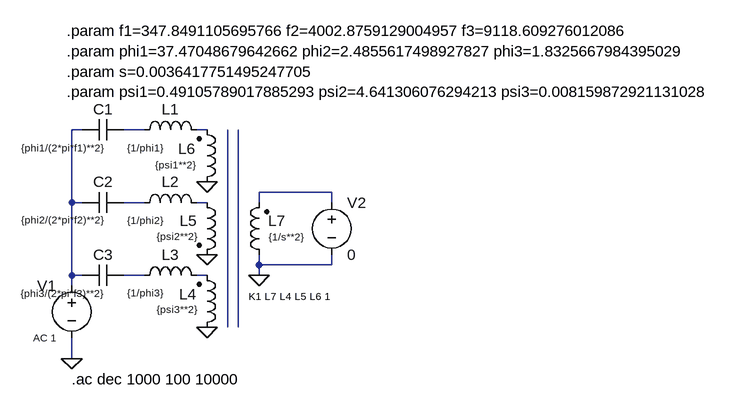
[diagram p0: schematic ME_Diaphragm_3DOF_linear.asc]
ME_Diaphragm_3DOF_linear.asc, the LTspice schematic file:
Version 4
SHEET 1 27848 15192
WIRE 25392 14592 25376 14592
WIRE 25488 14592 25456 14592
WIRE 25584 14592 25568 14592
WIRE 25776 14688 25664 14688
WIRE 25376 14704 25376 14592
WIRE 25392 14704 25376 14704
WIRE 25488 14704 25456 14704
WIRE 25584 14704 25568 14704
WIRE 25664 14704 25664 14688
WIRE 25776 14704 25776 14688
WIRE 25664 14800 25664 14784
WIRE 25776 14800 25776 14784
WIRE 25776 14800 25664 14800
WIRE 25376 14816 25376 14704
WIRE 25392 14816 25376 14816
WIRE 25488 14816 25456 14816
WIRE 25584 14816 25568 14816
WIRE 25664 14816 25664 14800
WIRE 25376 14832 25376 14816
WIRE 25376 14944 25376 14912
FLAG 25376 14944 0
FLAG 25584 14784 0
FLAG 25584 14672 0
FLAG 25584 14896 0
FLAG 25664 14816 0
SYMBOL cap 25456 14576 R90
WINDOW 0 0 32 VBottom 2
WINDOW 3 33 95 VTop 1
SYMATTR InstName C1
SYMATTR Value {phi1/(2*pi*f1)**2}
SYMBOL cap 25456 14688 R90
WINDOW 0 0 32 VBottom 2
WINDOW 3 32 95 VTop 1
SYMATTR InstName C2
SYMATTR Value {phi2/(2*pi*f2)**2}
SYMBOL ind 25472 14608 R270
WINDOW 0 32 56 VTop 2
WINDOW 3 -1 17 VBottom 1
SYMATTR InstName L1
SYMATTR Value {1/phi1}
SYMBOL ind 25472 14720 R270
WINDOW 0 32 56 VTop 2
WINDOW 3 -1 17 VBottom 1
SYMATTR InstName L2
SYMATTR Value {1/phi2}
SYMBOL voltage 25376 14816 M0
WINDOW 3 24 96 Left 1
SYMATTR Value AC 1
SYMATTR InstName V1
SYMBOL cap 25456 14800 R90
WINDOW 0 0 32 VBottom 2
WINDOW 3 33 96 VTop 1
SYMATTR InstName C3
SYMATTR Value {phi3/(2*pi*f3)**2}
SYMBOL ind 25472 14832 R270
WINDOW 0 32 56 VTop 2
WINDOW 3 0 17 VBottom 1
SYMATTR InstName L3
SYMATTR Value {1/phi3}
SYMBOL ind2 25568 14912 M180
WINDOW 0 0 67 Right 2
WINDOW 3 0 44 Right 1
SYMATTR InstName L4
SYMATTR Value {psi3**2}
SYMATTR Type ind
SYMBOL ind2 25568 14688 R0
WINDOW 0 1 44 Right 2
WINDOW 3 0 68 Right 1
SYMATTR InstName L5
SYMATTR Value {psi2**2}
SYMATTR Type ind
SYMBOL ind2 25568 14688 M180
WINDOW 0 -1 67 Right 2
WINDOW 3 -2 42 Right 1
SYMATTR InstName L6
SYMATTR Value {psi1**2}
SYMATTR Type ind
SYMBOL ind2 25680 14800 R180
WINDOW 0 2 68 Right 2
WINDOW 3 1 43 Right 1
SYMATTR InstName L7
SYMATTR Value {1/s**2}
SYMATTR Type ind
SYMBOL voltage 25776 14688 R0
SYMATTR InstName V2
SYMATTR Value 0
TEXT 25376 14976 Left 2 !.ac dec 1000 100 10000
TEXT 25368 14440 Left 2 !.param f1=347.8491105695766 f2=4002.8759129004957 f3=9118.609276012086\n.param phi1=37.47048679642662 phi2=2.4855617498927827 phi3=1.8325667984395029\n.param s=0.0036417751495247705\n.param psi1=0.49105789017885293 psi2=4.641306076294213 psi3=0.008159872921131028
TEXT 25648 14848 Left 1 !K1 L7 L4 L5 L6 1
LINE Normal 25616 14896 25616 14592
LINE Normal 25632 14896 25632 14592

The netlist it stands for:
* ME_Diaphragm_3DOF_linear.asc
C1 N002 N001 {phi1/(2*pi*f1)**2}
C2 N005 N001 {phi2/(2*pi*f2)**2}
L1 N002 N003 {1/phi1}
L2 N005 N006 {1/phi2}
V1 N001 0 AC 1
C3 N007 N001 {phi3/(2*pi*f3)**2}
L3 N007 N008 {1/phi3}
L4 0 N008 {psi3**2}
L5 N006 0 {psi2**2}
L6 0 N003 {psi1**2}
L7 0 N004 {1/s**2}
V2 N004 0 0
.ac dec 1000 100 10000
.param f1=347.8491105695766 f2=4002.8759129004957 f3=9118.609276012086
.param phi1=37.47048679642662 phi2=2.4855617498927827 phi3=1.8325667984395029
.param s=0.0036417751495247705
.param psi1=0.49105789017885293 psi2=4.641306076294213 psi3=0.008159872921131028
K1 L7 L4 L5 L6 1
.backanno
.end

* Results of the author's LTspice run, read from the files saved beside the schematic
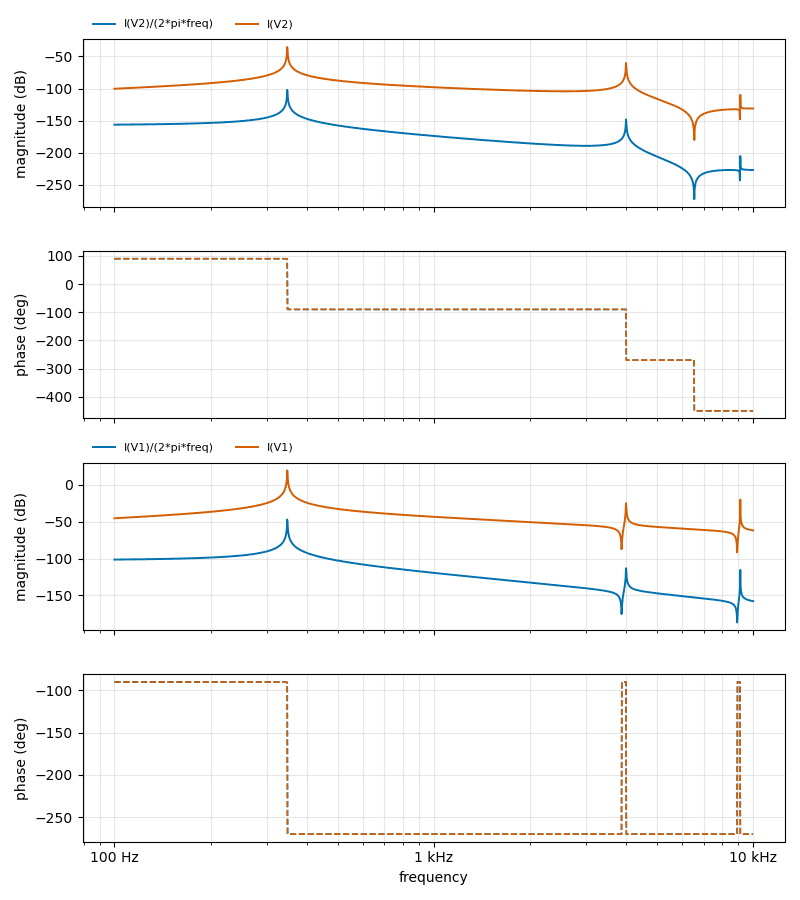
[diagram p1: AC Analysis of ME_Diaphragm_3DOF_linear.asc, plotted from the saved traces]
* AC Analysis, 1 run:
*   I(V2)/(2*pi*freq): -156.35 dB at 100 Hz, -227.12 dB at 10 kHz, peak -102.16 dB at 347.5 Hz, 3 dB below the peak at 347.3 Hz and 348.2 Hz
*   I(V2): -100.39 dB at 100 Hz, -131.16 dB at 10 kHz, peak -35.38 dB at 347.5 Hz, 3 dB below the peak at 347.3 Hz and 348.2 Hz
*   I(V1)/(2*pi*freq): -101.36 dB at 100 Hz, -157.72 dB at 10 kHz, peak -47.21 dB at 347.5 Hz, 3 dB below the peak at 347.3 Hz and 348.2 Hz
*   I(V1): -45.39 dB at 100 Hz, -61.75 dB at 10 kHz, peak 19.58 dB at 347.5 Hz, 3 dB below the peak at 347.3 Hz and 348.2 Hz